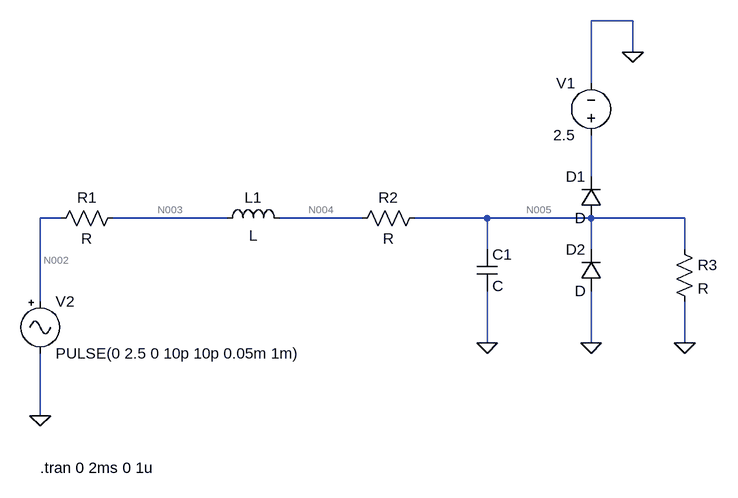
[diagram p0: schematic Lab 4 - Sec A #3A-Fig 2(b).asc]
Lab 4 - Sec A #3A-Fig 2(b).asc, the LTspice schematic file:
Version 4
SHEET 1 1064 680
WIRE 928 -288 864 -288
WIRE 928 -240 928 -288
WIRE 864 -192 864 -288
WIRE 864 -48 864 -112
WIRE 48 16 16 16
WIRE 304 16 128 16
WIRE 512 16 384 16
WIRE 704 16 592 16
WIRE 864 16 704 16
WIRE 1008 16 864 16
WIRE 704 64 704 16
WIRE 864 64 864 16
WIRE 1008 64 1008 16
WIRE 16 144 16 16
WIRE 704 208 704 128
WIRE 864 208 864 128
WIRE 1008 208 1008 144
WIRE 16 320 16 224
FLAG 16 320 0
FLAG 704 208 0
FLAG 864 208 0
FLAG 1008 208 0
FLAG 928 -240 0
SYMBOL res 144 0 R90
WINDOW 0 0 56 VBottom 2
WINDOW 3 32 56 VTop 2
SYMATTR InstName R1
SYMBOL ind 288 32 R270
WINDOW 0 32 56 VTop 2
WINDOW 3 5 56 VBottom 2
SYMATTR InstName L1
SYMBOL res 608 0 R90
WINDOW 0 0 56 VBottom 2
WINDOW 3 32 56 VTop 2
SYMATTR InstName R2
SYMBOL cap 688 64 R0
SYMATTR InstName C1
SYMBOL diode 880 16 R180
WINDOW 0 24 64 Left 2
WINDOW 3 24 0 Left 2
SYMATTR InstName D1
SYMBOL diode 880 128 R180
WINDOW 0 24 64 Left 2
WINDOW 3 24 0 Left 2
SYMATTR InstName D2
SYMBOL res 992 48 R0
SYMATTR InstName R3
SYMBOL voltage 864 -96 R180
WINDOW 0 24 96 Left 2
WINDOW 3 24 16 Left 2
SYMATTR InstName V1
SYMATTR Value 2.5
SYMBOL Misc\\signal 16 128 R0
SYMATTR InstName V2
SYMATTR Value PULSE(0 2.5 0 10p 10p 0.05m 1m)
TEXT 16 400 Left 2 !.tran 0 2ms 0 1u

The netlist it stands for:
* Lab 4 - Sec A #3A-Fig 2(b).asc
R1 N003 N002 R
L1 N003 N004 L
R2 N005 N004 R
C1 N005 0 C
D1 N005 N001 D
D2 0 N005 D
R3 N005 0 R
V1 N001 0 2.5
V2 N002 0 PULSE(0 2.5 0 10p 10p 0.05m 1m)
.model D D
.lib standard.dio
.tran 0 2ms 0 1u
.backanno
.end

* Results of the author's LTspice run, read from the files saved beside the schematic
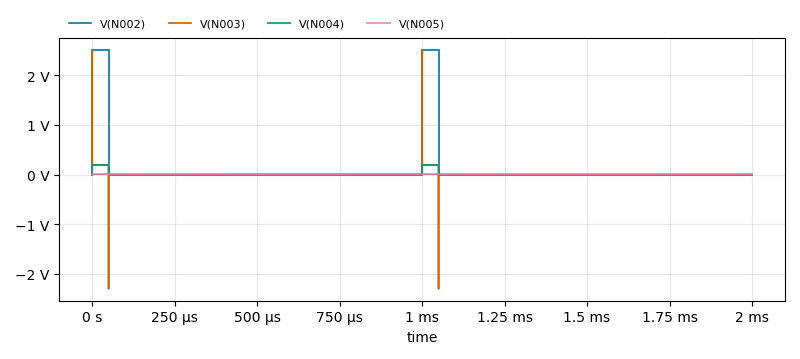
[diagram p1: Transient Analysis of Lab 4 - Sec A #3A-Fig 2(b).asc, plotted from the saved traces]
* Transient Analysis, 1 run:
*   V(N002): min 0 V, max 2.5 V, average 125 mV, rms 559 mV, last 0 V
*   V(N003): min -2.299 V, max 2.493 V, average 9.689 mV, rms 43.47 mV, last 0 V
*   V(N004): min 0 V, max 193.7 mV, average 9.686 mV, rms 43.32 mV, last 0 V
*   V(N005): min 0 V, max 9.225 mV, average 461.2 µV, rms 2.063 mV, last 0 V